# EAGLE schematic WLS (EAGLE 9.6.2)
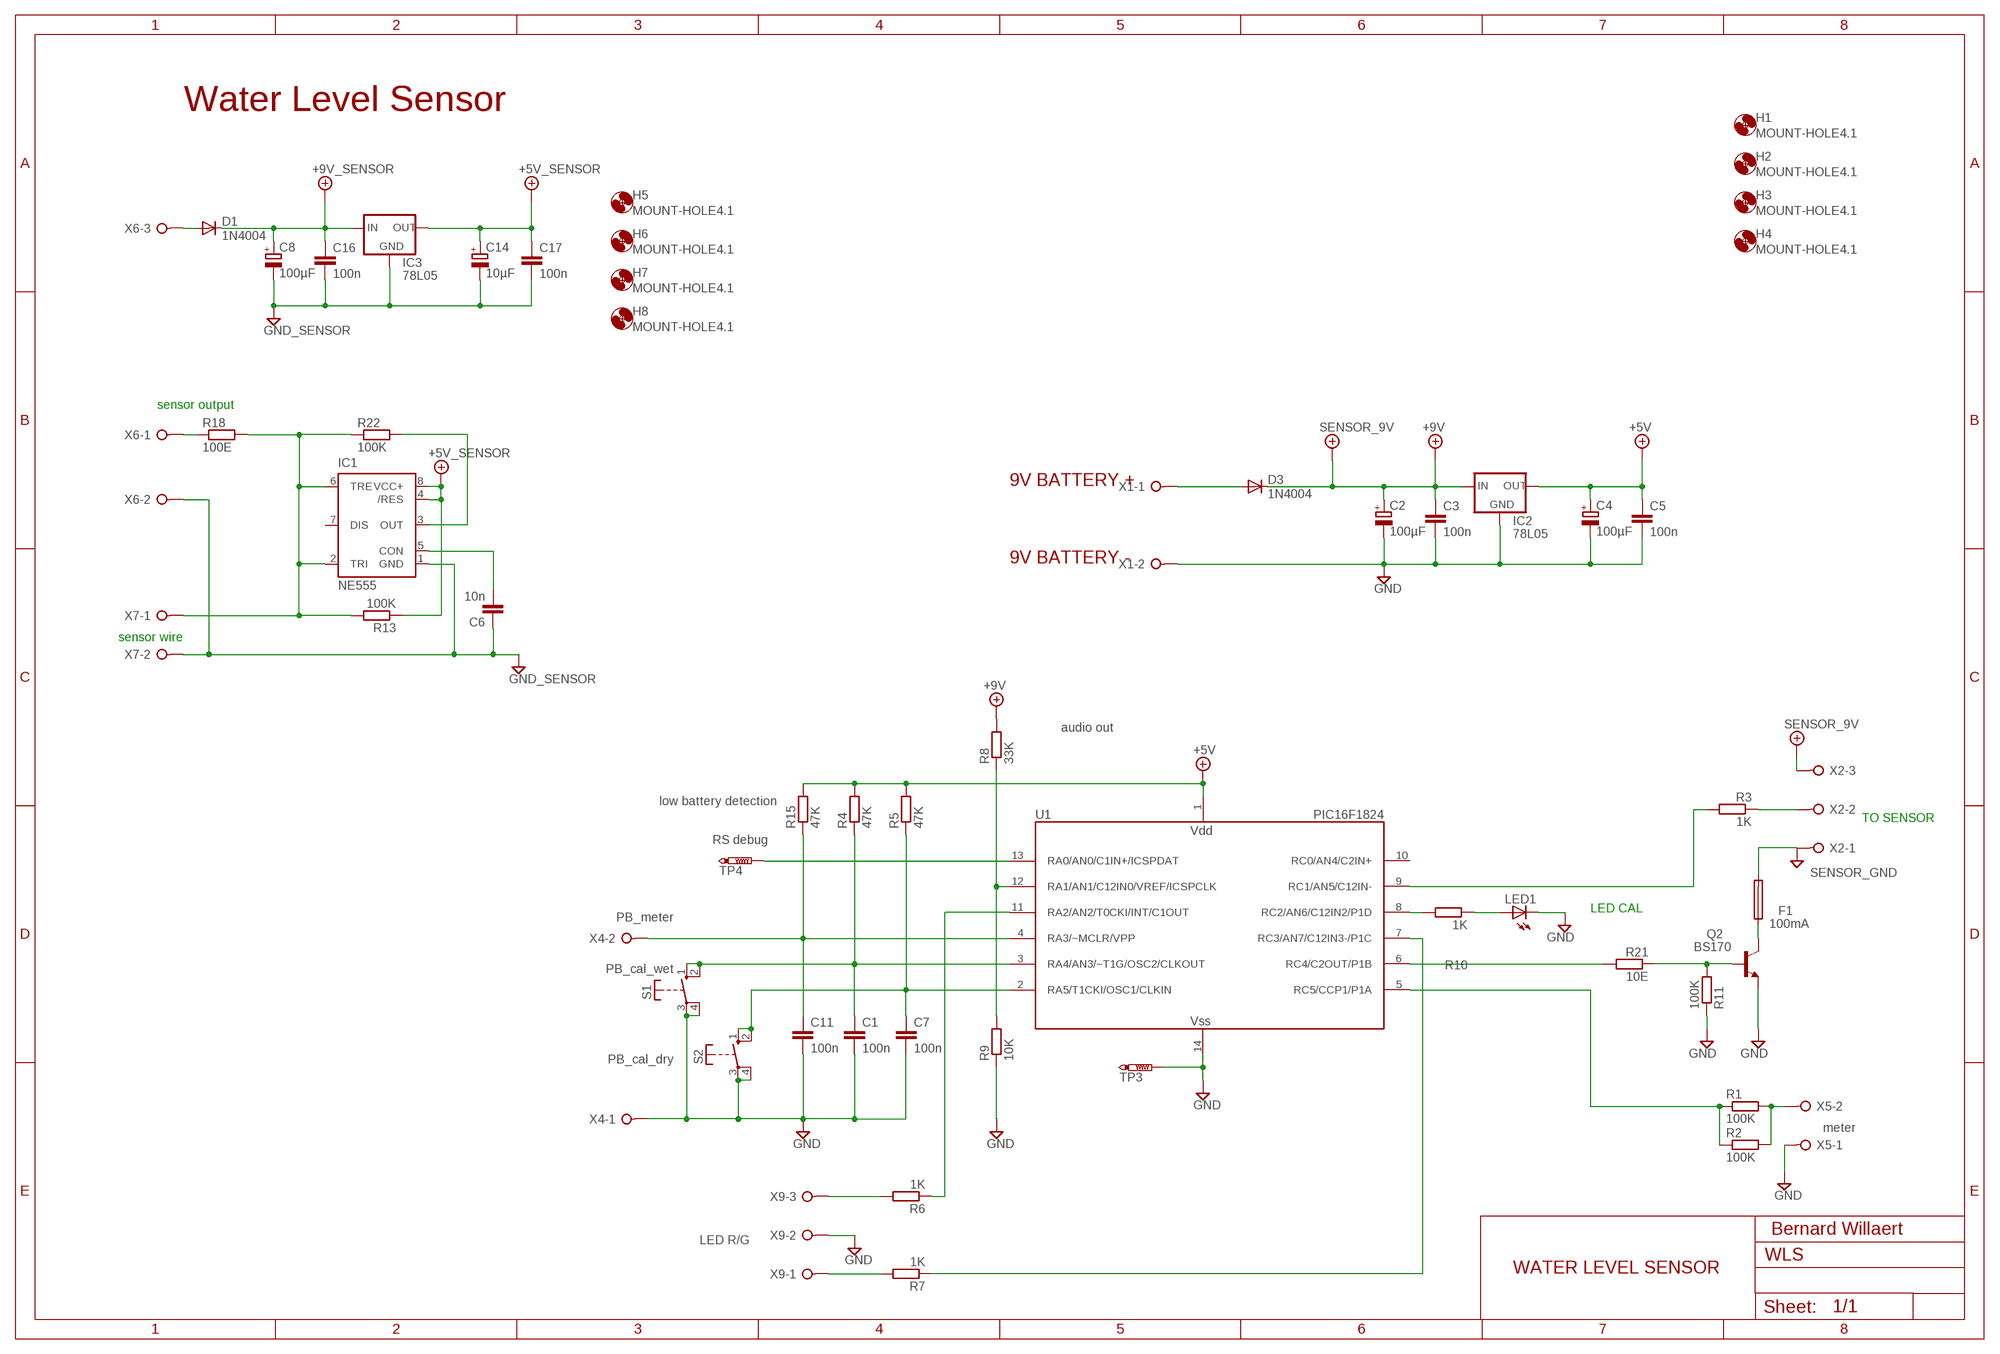
[diagram p0: schematic, sheet 1]

## Parts
C1  100n  C-EU050-025X075  [C050-025X075]
C2  100µF  CPOL-EUE5-6  [E5-6]
C3  100n  C-EU050-025X075  [C050-025X075]
C4  100µF  CPOL-EUE5-6  [E5-6]
C5  100n  C-EU050-025X075  [C050-025X075]
C6  10n  C-EU050-025X075  [C050-025X075]
C7  100n  C-EU050-025X075  [C050-025X075]
C8  100µF  CPOL-EUE5-6  [E5-6]
C11  100n  C-EU050-025X075  [C050-025X075]
C14  10µF  CPOL-EUE5-6  [E5-6]
C16  100n  C-EU050-025X075  [C050-025X075]
C17  100n  C-EU050-025X075  [C050-025X075]
D1  1N4004  [DO41-10]
D3  1N4004  [DO41-10]
F1  100mA  TR5  [TR5]
H1  MOUNT-HOLE4.1  [4,1]
H2  MOUNT-HOLE4.1  [4,1]
H3  MOUNT-HOLE4.1  [4,1]
H4  MOUNT-HOLE4.1  [4,1]
H5  MOUNT-HOLE4.1  [4,1]
H6  MOUNT-HOLE4.1  [4,1]
H7  MOUNT-HOLE4.1  [4,1]
H8  MOUNT-HOLE4.1  [4,1]
IC1  NE555  [DIL-08]
IC2  78L05  78LXX  [78LXX]
IC3  78L05  78LXX  [78LXX]
LED1  LED3MM  [LED3MM]
Q2  BS170  BC549-NPN-TO92-CBE  [TO92-CBE]
R1  100K  R-EU_0207/10  [0207/10]
R2  100K  R-EU_0207/10  [0207/10]
R3  1K  R-EU_0207/10  [0207/10]
R4  47K  R-EU_0207/10  [0207/10]
R5  47K  R-EU_0207/10  [0207/10]
R6  1K  R-EU_0207/10  [0207/10]
R7  1K  R-EU_0207/10  [0207/10]
R8  33K  R-EU_0207/10  [0207/10]
R9  10K  R-EU_0207/10  [0207/10]
R10  1K  R-EU_0207/10  [0207/10]
R11  100K  R-EU_0207/10  [0207/10]
R13  100K  R-EU_0207/10  [0207/10]
R15  47K  R-EU_0207/10  [0207/10]
R18  100E  R-EU_0207/10  [0207/10]
R21  10E  R-EU_0207/10  [0207/10]
R22  100K  R-EU_0207/10  [0207/10]
S1  DTE6K  [DTE6K]
S2  DTE6K  [DTE6K]
TP3  PTR1PAD1-17  [P1-17]
TP4  PTR1PAD1-17  [P1-17]
U1  PIC16F1824  PIC16616P  [DIP-14]
X1  W237-02P  [W237-132]
X2  W237-3E  [W237-3E]
X4  W237-02P  [W237-132]
X5  W237-02P  [W237-132]
X6  W237-3E  [W237-3E]
X7  W237-02P  [W237-132]
X9  W237-3E  [W237-3E]

## Nets
+5V: C4.+ C5.1 C14.+ C17.1 IC2.OUT IC3.OUT R4.2 R5.2 R15.2 U1.1(VDD) ; supply symbol labelled +5V_SENSOR
+12V: C2.+ C3.1 C8.+ C16.1 D1.C D3.C IC1.4(/RES) IC1.8(VCC+) IC2.IN IC3.IN R8.2 R13.1 X2.3 ; supply symbol labelled +9V, +9V_SENSOR, +5V_SENSOR, SENSOR_9V
GND: C2.- C3.2 C4.- C5.2 C6.1 C8.- C14.- C16.2 C17.2 F1.2 IC1.1(GND) IC2.GND IC3.GND LED1.K(C) Q2.E R9.1 R11.1 TP3.TP U1.14(VSS) X1.2 X2.1 X5.1 X6.2 X7.2 X9.2 ; supply symbol labelled GND_SENSOR, SENSOR_GND
N$1: IC1.2(TRI) IC1.6(TRE) R13.2 R18.2 R22.1 X7.1
N$2: R21.2 U1.6(RC4/C2OUT/P1B)
N$3: IC1.3(OUT) R22.2
N$4: C1.1 R4.1 S1.1(S) S1.2(S) U1.3(RA4/AN3/~T1G/OSC2/CLKOUT)
N$5: R3.1 X2.2
N$6: R3.2 U1.9(RC1/AN5/C12IN-)
N$7: R6.2 X9.3
N$8: R7.2 X9.1
N$9: R7.1 U1.7(RC3/AN7/C12IN3-/P1C)
N$10: C11.1 R15.1 U1.4(RA3/~MCLR/VPP) X4.2
N$11: R6.1 U1.11(RA2/AN2/T0CKI/INT/C1OUT)
N$12: C6.2 IC1.5(CON)
N$13: R10.2 U1.8(RC2/AN6/C12IN2/P1D)
N$14: R18.1 X6.1
N$15: R1.1 R2.1 U1.5(RC5/CCP1/P1A)
N$16: R1.2 R2.2 X5.2
N$17: R8.1 R9.2 U1.12(RA1/AN1/C12IN0/VREF/ICSPCLK)
N$18: Q2.B R11.2 R21.1
N$19: D1.A X6.3
N$21: TP4.TP U1.13(RA0/AN0/C1IN+/ICSPDAT)
N$22: LED1.A R10.1
N$23: F1.1 Q2.C
N$25: C1.2 C7.2 C11.2 S1.3(P) S1.4(P) S2.3(P) S2.4(P) X4.1 ; supply symbol labelled GND
N$27: C7.1 R5.1 S2.1(S) S2.2(S) U1.2(RA5/T1CKI/OSC1/CLKIN)
N$28: D3.A X1.1
Unconnected: IC1.7(DIS) U1.10(RC0/AN4/C2IN+)

## Notes on the sheet
- Water Level Sensor
- sensor output
- 9V BATTERY +
- 9V BATTERY -
- sensor wire
- audio out
- low battery detection
- TO SENSOR
- RS debug
- PB_meter | LED CAL
- PB_cal_wet
- PB_cal_dry
- meter
- LED R/G | Bernard Willaert
- WATER LEVEL SENSOR

## Library data of the parts
C1 C3 C5-C7 C11 C16 C17 = rcl:C-EU: CAPACITOR, European symbol
C2 C4 C8 C14 = rcl:CPOL-EU: POLARIZED CAPACITOR, European symbol
D1 D3 = diode:1N4004: DIODE general purpose rectifier, 1 A
F1 = fuse:TR5: FUSE Wickmann; OC_FARNELL: unknown; OC_NEWARK: unknown
H1-H8 = holes:MOUNT-HOLE: MOUNTING HOLE with drill center marker
IC1 = st-microelectronics:NE555: General purpose bipolar Timer; MF: Arrow Electronics; MPN: NE555N; OC_FARNELL: 1467742; OC_NEWARK: 89K1486
IC2 IC3 = v-reg:78LXX: VOLTAGE REGULATOR
LED1 = led:LED: LED OSRAM: - CHIPLED LG R971, LG N971, LY N971, LG Q971, LY Q971, LO R971, LY R971 LH N974, LH R974 LS Q976, LO Q976, LY Q976 LO Q996 - Hyper CHIPLED LW Q18S LB Q993, LB Q99A, LB R99A - SideLED LS A670, LO A670, LY A670, LG A670, LP A670 LB A673, LV A673, LT A673, LW A673 LH A674 LY A675 LS A676, LA A676, LO A676, LY A676, LW A676 LS A679, LY A679, LG A679 - Hyper Micro SIDELED® LS Y876, LA Y876, LO Y876, LY Y876 LT Y87S - SmartLED LW L88C, LW L88S LB L89C, LB L89S, LG L890 LS L89K, LO L89K, LY L89K LS L896, LA L896, LO L896, LY L896 - TOPLED LS T670, LO T670, LY T670, LG T670, LP T670 LSG T670, LSP T670, LSY T670, LOP T670, LYG T670 LG T671, LOG T671, LSG T671 LB T673, LV T673, LT T673, LW T673 LH T674 LS T676, LA T676, LO T676, LY T676, LB T676, LH T676, LSB T676, LW T676 LB T67C, LV T67C, LT T67C, LS T67K, LO T67K, LY T67K, LW E67C LS E67B, LA E67B, LO E67B, LY E67B, LB E67C, LV E67C, LT E67C LW T67C LS T679, LY T679, LG T679 LS T770, LO T770, LY T770, LG T770, LP T770 LB T773, LV T773, LT T773, LW T773 LH T774 LS E675, LA E675, LY E675, LS T675 LS T776, LA T776, LO T776, LY T776, LB T776 LHGB T686 LT T68C, LB T68C - Hyper Mini TOPLED® LB M676 - Mini TOPLED Santana® LG M470 LS M47K, LO M47K, LY M47K Source: http://www.osram.convergy.de LUXEON: - LUMILED® LXK2-PW12-R00, LXK2-PW12-S00, LXK2-PW14-U00, LXK2-PW14-V00 LXK2-PM12-R00, LXK2-PM12-S00, LXK2-PM14-U00 LXK2-PE12-Q00, LXK2-PE12-R00, LXK2-PE12-S00, LXK2-PE14-T00, LXK2-PE14-U00 LXK2-PB12-K00, LXK2-PB12-L00, LXK2-PB12-M00, LXK2-PB14-N00, LXK2-PB14-P00, LXK2-PB14-Q00 LXK2-PR12-L00, LXK2-PR12-M00, LXK2-PR14-Q00, LXK2-PR14-R00 LXK2-PD12-Q00, LXK2-PD12-R00, LXK2-PD12-S00 LXK2-PH12-R00, LXK2-PH12-S00 LXK2-PL12-P00, LXK2-PL12-Q00, LXK2-PL12-R00 Source: www.luxeon.com KINGBRIGHT: KA-3528ASYC Source: www.kingbright.com
Q2 = transistor:*-NPN-: NPN Transistror BF959 corrected 2008.03.06
R1-R11 R13 R15 R18 R21 R22 = rcl:R-EU_: RESISTOR, European symbol
S1 S2 = switch-misc:DT: ITT SWITCH
TP3 TP4 = testpad:PTR1: TEST PIN
U1 = microchip2:PIC16*616: Microchip PIC16F616 and PIC16HV616 14-pin 8-bit Flash microcontroller 2048 words program memory, 128 bytes RAM 11 I/O, 8 10-bit A/D, 2 comparators, 2 8-bit timers, 1 16-bit timer High-voltage variant (HV) available
X1 X4 X5 X7 = con-wago-508:W237-02P: WAGO SREW CLAMP; OC_FARNELL: unknown; OC_NEWARK: unknown
X2 X6 X9 = con-wago-508:W237-3E: WAGO SREW CLAMP; OC_FARNELL: unknown; OC_NEWARK: unknown